# EAGLE design Rev A (New Routing) (EAGLE 9.6.2)
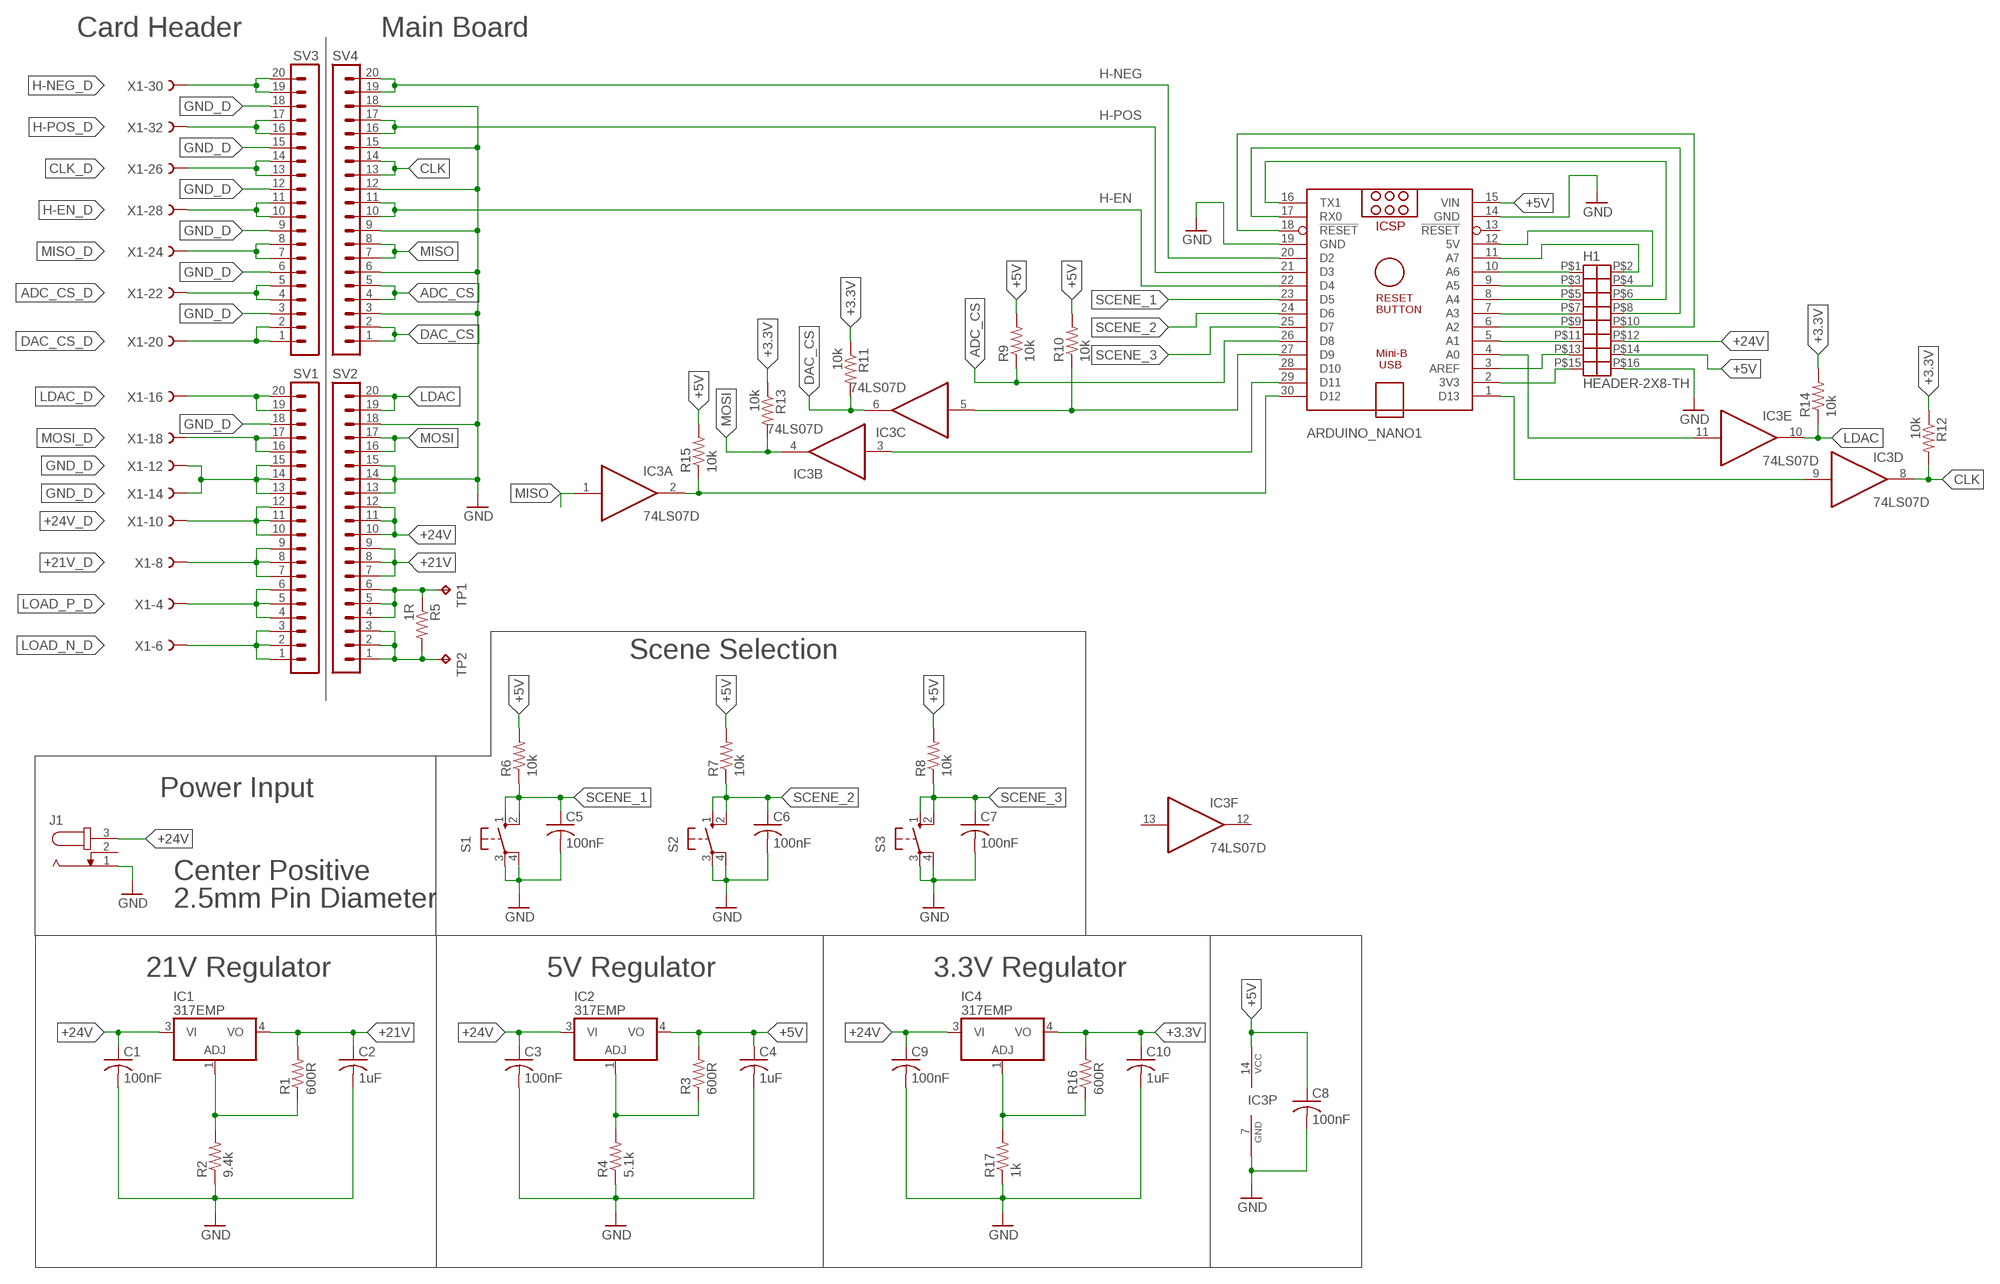
[diagram p0: schematic, sheet 1]

## Parts
ARDUINO_NANO1  ARDUINO_NANO  [ARDUINO_NANO]
C1  100nF  C-USC0603  [C0603]
C2  1uF  C-USC1206  [C1206]
C3  100nF  C-USC0603  [C0603]
C4  1uF  C-USC1206  [C1206]
C5  100nF  C-USC0603  [C0603]
C6  100nF  C-USC0603  [C0603]
C7  100nF  C-USC0603  [C0603]
C8  100nF  C-USC0603  [C0603]
C9  100nF  C-USC0603  [C0603]
C10  1uF  C-USC1206  [C1206]
H1  HEADER-2X8-TH  [HEADER-2X8-TH]
IC1  317EMP  [SOT223]
IC2  317EMP  [SOT223]
IC3  74LS07D  [SO14]
IC4  317EMP  [SOT223]
J1  JACK-PLUG1  [SPC4078]
R1  600R  R-US_R0603  [R0603]
R2  9.4k  R-US_R0603  [R0603]
R3  600R  R-US_R0603  [R0603]
R4  5.1k  R-US_R0603  [R0603]
R5  1R  R-US_R1206  [R1206]
R6  10k  R-US_R0603  [R0603]
R7  10k  R-US_R0603  [R0603]
R8  10k  R-US_R0603  [R0603]
R9  10k  R-US_R0603  [R0603]
R10  10k  R-US_R0603  [R0603]
R11  10k  R-US_R0603  [R0603]
R12  10k  R-US_R0603  [R0603]
R13  10k  R-US_R0603  [R0603]
R14  10k  R-US_R0603  [R0603]
R15  10k  R-US_R0603  [R0603]
R16  600R  R-US_R0603  [R0603]
R17  1k  R-US_R0603  [R0603]
S1  10-XX  [B3F-10XX]
S2  10-XX  [B3F-10XX]
S3  10-XX  [B3F-10XX]
SV1  MA20-1  [MA20-1]
SV2  MA20-1W  [MA20-1W]
SV3  MA20-1  [MA20-1]
SV4  MA20-1W  [MA20-1W]
TP1  TPB2,54  [B2,54]
TP2  TPB2,54  [B2,54]
X1  FH15  [FH15]

## Nets
+3.3V: C10.1 IC4.4(VO) R11.1 R12.1 R13.1 R14.2 R16.2
+5V: ARDUINO_NANO1.15(VIN) C4.1 C8.1 H1.P$14 IC2.4(VO) IC3.14(P:VCC) R3.2 R6.2 R7.2 R8.2 R9.2 R10.2 R15.2
+21V: C2.1 IC1.4(VO) R1.2 SV2.7 SV2.8 SV2.9
+21V_D: SV1.7 SV1.8 SV1.9 X1.8
+24V: C1.1 C3.1 C9.1 H1.P$12 IC1.3(VI) IC2.3(VI) IC4.3(VI) J1.3 SV2.10 SV2.11 SV2.12
+24V_D: SV1.10 SV1.11 SV1.12 X1.10
ADC_CS: ARDUINO_NANO1.26(D8) R9.1 SV4.4 SV4.5
ADC_CS_D: SV3.4 SV3.5 X1.22
CLK: IC3.8(D:O) R12.2 SV4.13 SV4.14
CLK_D: SV3.13 SV3.14 X1.26
DAC_CS: IC3.6(C:O) R11.2 SV4.1 SV4.2
DAC_CS_D: SV3.1 SV3.2 X1.20
GND: ARDUINO_NANO1.14(GND) ARDUINO_NANO1.19(GND) C1.2 C2.2 C3.2 C4.2 C5.2 C6.2 C7.2 C8.2 C9.2 C10.2 H1.P$16 IC3.7(P:GND) J1.1 R2.1 R4.1 R17.1 S1.3(P) S1.4(P1) S2.3(P) S2.4(P1) S3.3(P) S3.4(P1) SV2.13 SV2.14 SV2.15 SV2.18 SV4.3 SV4.6 SV4.9 SV4.12 SV4.15 SV4.18
GND_D: SV1.13 SV1.14 SV1.15 SV1.18 SV3.3 SV3.6 SV3.9 SV3.12 SV3.15 SV3.18 X1.12 X1.14
H-EN_D: SV3.10 SV3.11 X1.28
H-NEG_D: SV3.19 SV3.20 X1.30
H-POS_D: SV3.16 SV3.17 X1.32
LDAC: IC3.10(E:O) R14.1 SV2.19 SV2.20
LDAC_D: SV1.19 SV1.20 X1.16
LOAD_N_D: SV1.1 SV1.2 SV1.3 X1.6
LOAD_P_D: SV1.4 SV1.5 SV1.6 X1.4
MISO: IC3.1(A:I) SV4.7 SV4.8
MISO_D: SV3.7 SV3.8 X1.24
MOSI: IC3.4(B:O) R13.2 SV2.16 SV2.17
MOSI_D: SV1.16 SV1.17 X1.18
N$1: IC2.1(ADJ) R3.1 R4.2
N$2: IC1.1(ADJ) R1.1 R2.2
N$3: ARDUINO_NANO1.20(D2) SV4.19 SV4.20
N$4: ARDUINO_NANO1.2(3V3) H1.P$15
N$5: ARDUINO_NANO1.21(D3) SV4.16 SV4.17
N$6: ARDUINO_NANO1.3(AREF) H1.P$13
N$7: ARDUINO_NANO1.5(A1) H1.P$11
N$8: ARDUINO_NANO1.6(A2) H1.P$9
N$9: ARDUINO_NANO1.22(D4) SV4.10 SV4.11
N$10: ARDUINO_NANO1.7(A3) H1.P$7
N$11: ARDUINO_NANO1.8(A4) H1.P$5
N$12: ARDUINO_NANO1.9(A5) H1.P$3
N$13: ARDUINO_NANO1.10(A6) H1.P$1
N$14: ARDUINO_NANO1.11(A7) H1.P$2
N$15: ARDUINO_NANO1.12(5V) H1.P$4
N$16: ARDUINO_NANO1.16(TX1) H1.P$6
N$17: ARDUINO_NANO1.17(RX0) H1.P$8
N$18: ARDUINO_NANO1.18(!RESET) H1.P$10
N$19: ARDUINO_NANO1.27(D9) IC3.5(C:I) R10.1
N$20: ARDUINO_NANO1.1(D13) IC3.9(D:I)
N$21: ARDUINO_NANO1.29(D11) IC3.3(B:I)
N$22: R5.1 SV2.4 SV2.5 SV2.6 TP1.TP
N$23: R5.2 SV2.1 SV2.2 SV2.3 TP2.TP
N$24: ARDUINO_NANO1.4(A0) IC3.11(E:I)
N$25: ARDUINO_NANO1.30(D12) IC3.2(A:O) R15.1
N$26: IC4.1(ADJ) R16.1 R17.2
SCENE_1: ARDUINO_NANO1.23(D5) C5.1 R6.1 S1.1(S) S1.2(S1)
SCENE_2: ARDUINO_NANO1.24(D6) C6.1 R7.1 S2.1(S) S2.2(S1)
SCENE_3: ARDUINO_NANO1.25(D7) C7.1 R8.1 S3.1(S) S3.2(S1)
Unconnected: ARDUINO_NANO1.13(!RESET) ARDUINO_NANO1.28(D10) IC3.12(F:O) IC3.13(F:I) J1.2

## Notes on the sheet
- Card Header | Main Board
- H-NEG
- H-POS
- H-EN
- Scene Selection
- Power Input
- Center Positive
- 2.5mm Pin Diameter
- 21V Regulator | 5V Regulator | 3.3V Regulator

## Library data of the parts
ARDUINO_NANO1 = ArduinoNanoV30:ARDUINO_NANO: Arduino Nano V3.0 Overview: The Arduino Nano is a small, complete, and breadboard-friendly board based on the ATmega328 (Arduino Nano 3.x) or ATmega168 (Arduino Nano 2.x). It has more or less the same functionality of the Arduino Duemilanove, but in a different package. It lacks only a DC power jack, and works with a Mini-B USB cable instead of a standard one. The Nano was designed and is being produced by Gravitech. Specifications: Microcontroller Atmel ATmega168 or ATmega328 Operating Voltage (logic level) 5 V Input Voltage (recommended) 7-12 V Input Voltage (limits) 6-20 V Digital I/O Pins 14 (of which 6 provide PWM output) Analog Input Pins 8 DC Current per I/O Pin 40 mA Flash Memory 16 KB (ATmega168) or 32 KB (ATmega328) of which 2 KB used by bootloader SRAM 1 KB (ATmega168) or 2 KB (ATmega328) EEPROM 512 bytes (ATmega168) or 1 KB (ATmega328) Clock Speed 16 MHz Dimensions 0.73" x 1.70" Length 45 mm Width 18 mm Weigth 5 g Power: The Arduino Nano can be powered via the Mini-B USB connection, 6-20V unregulated external power supply (pin 30), or 5V regulated external power supply (pin 27). The power source is automatically selected to the highest voltage source. Memory: The ATmega168 has 16 KB of flash memory for storing code (of which 2 KB is used for the bootloader); the ATmega328 has 32 KB, (also with 2 KB used for the bootloader). The ATmega168 has 1 KB of SRAM and 512 bytes of EEPROM (which can be read and written with the EEPROM library); the ATmega328 has 2 KB of SRAM and 1 KB of EEPROM. Input and Output: Each of the 14 digital pins on the Nano can be used as an input or output, using pinMode(), digitalWrite(), and digitalRead() functions. They operate at 5 volts. Each pin can provide or receive a maximum of 40 mA and has an internal pull-up resistor (disconnected by default) of 20-50 kOhms. In addition, some pins have specialized functions. Visit Arduino - ArduinoBoardNano <https://www.arduino.cc/en/Main/ArduinoBoardNano>
C1-C10 = MMIModular Parts:C-US: CAPACITOR, American symbol; SPICEPREFIX: C
H1 = 4ms-main-parts:HEADER-2X8: SMT HEADER 2x8 Unshrouded: Cixi Langling LL1010-5C (HI TEMP 2*8PIN) Shrouded: Cixi Langling LL1007-3 (2*8PIN)
IC1 IC2 IC4 = linear:*317: Positive VOLTAGE REGULATOR
IC3 = 74xx-us:74*07: Hex BUFFER, open collector high-voltage output
J1 = con-jack:JACK-PLUG: DC POWER JACK Power Jack, DC, Right Angle, Through Hole, Rated 5A at 16VDC, PC Terminals Distributor: Farnell (www.Farnell.de) Drawing: 84N1161.pdf / 84N1162.pdf Manufacturer: SPC Technology (www.spctechnology.com) Type: SPC4077 / SPC 4078; OC_FARNELL: unknown; OC_NEWARK: unknown
R1-R17 = MMIModular Parts:R-US_: RESISTOR, American symbol; SPICEPREFIX: R
S1-S3 = switch-omron:10-XX: OMRON SWITCH; MPN: B3F-1000; OC_FARNELL: 176432; OC_NEWARK: 36M3542
SV1 SV3 = con-lstb:MA20-1: PIN HEADER; OC_FARNELL: unknown; OC_NEWARK: unknown
SV2 SV4 = con-lstb:MA20-1W: PIN HEADER; OC_FARNELL: unknown; OC_NEWARK: unknown
TP1 TP2 = testpad:TP: Test pad
X1 = con-vg:FH15: CONNECTOR female, 15 pins, type H, rows DZ

## Board
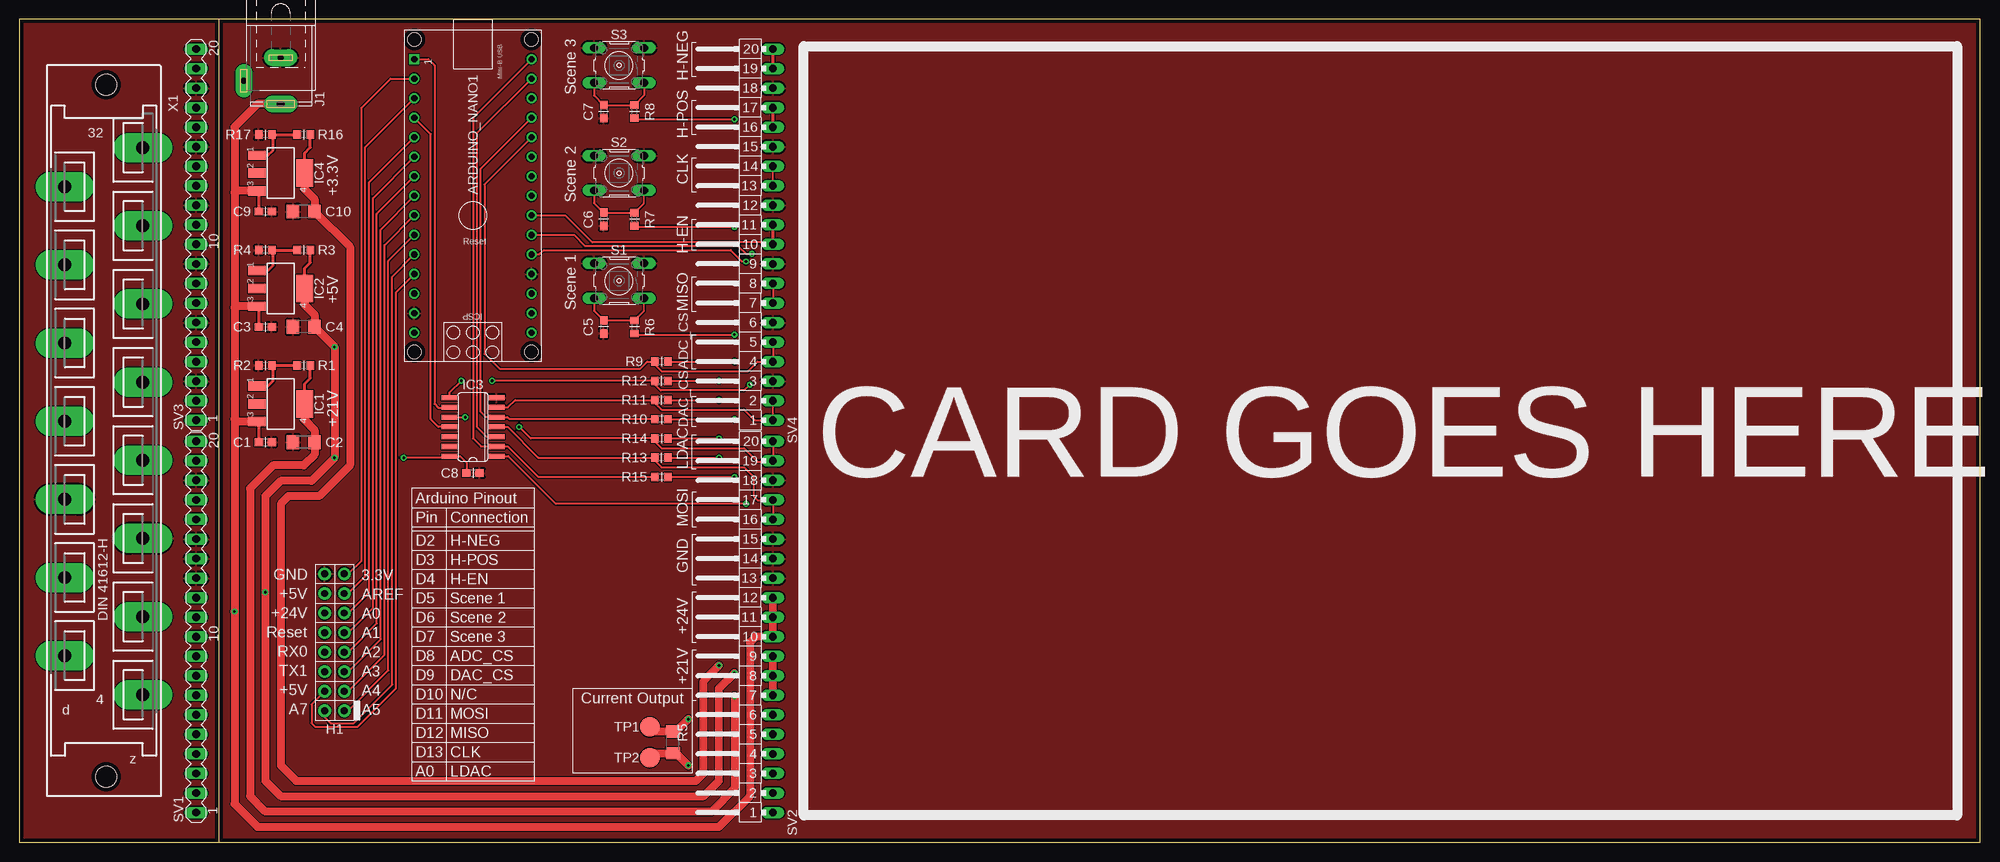
[diagram p1: board, top side]
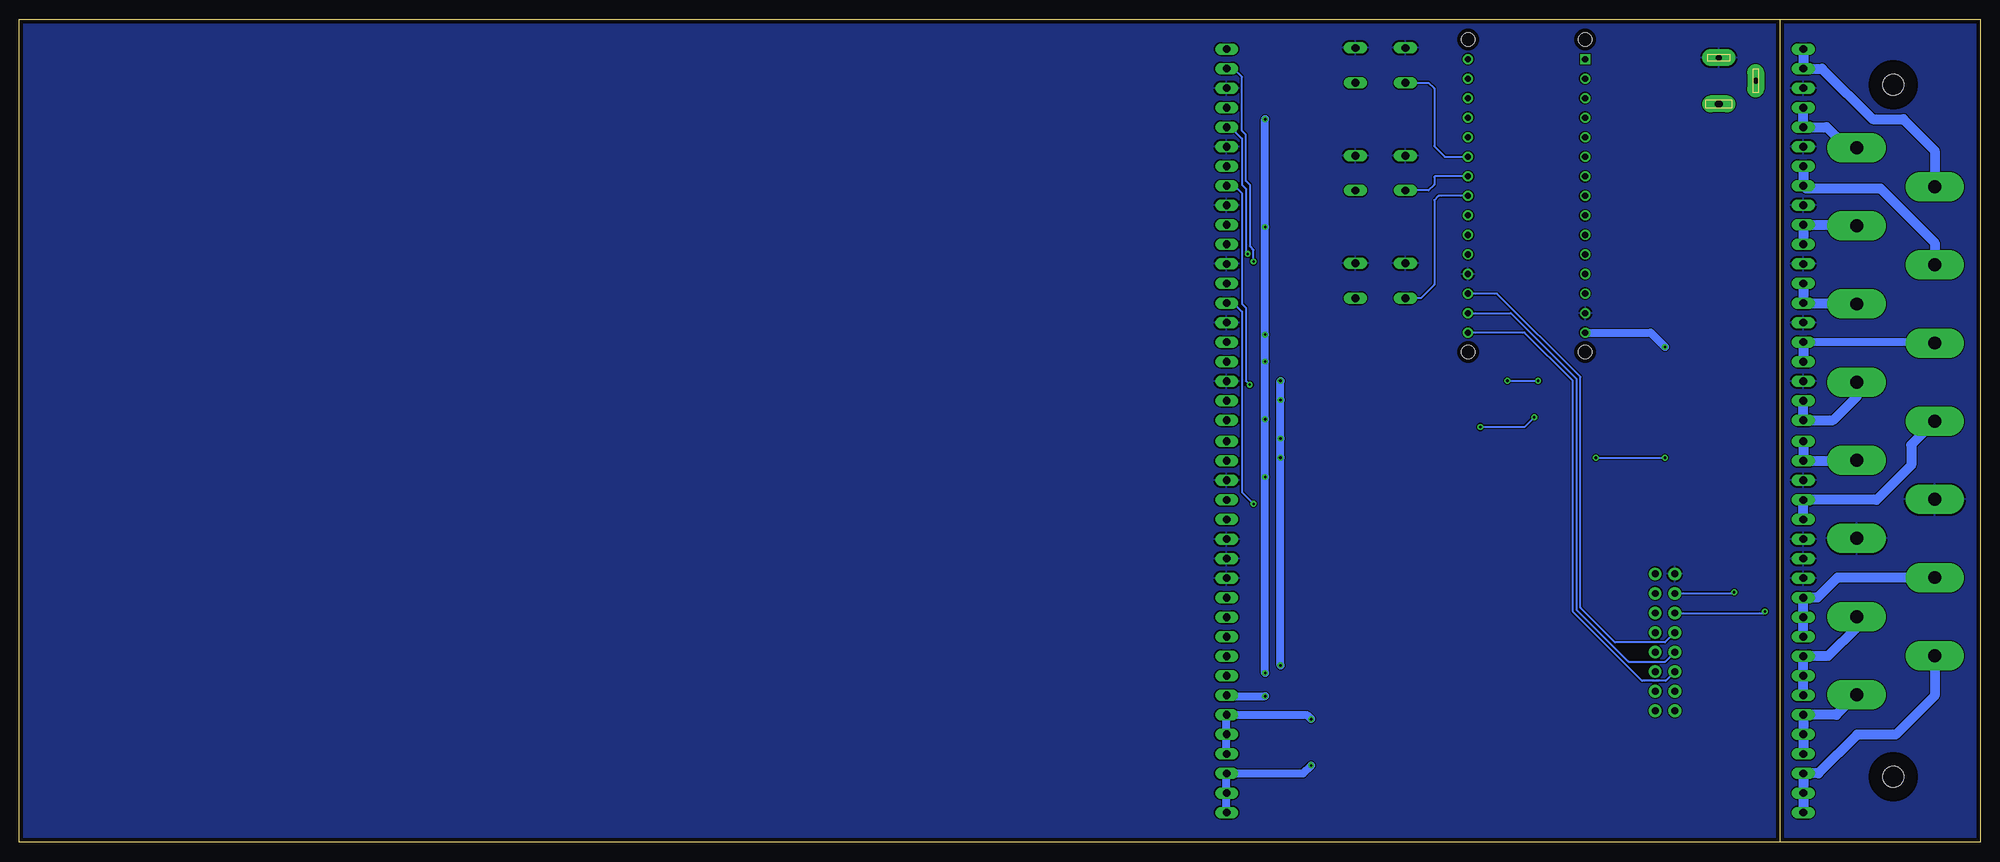
[diagram p2: board, bottom side, seen from below]

Size 255 x 107 mm. Coordinates in mm from the lower left corner, seen from the top.
Outline: 26,0 0,0 0,107 26,107
Outline: 26,0 255,0 255,107 26,107
Outline: 26,0 26,107
Copper layers (1*16): Top 0.035mm / dielectric 1.5mm / Bottom 0.035mm
Design rules "default *": minimum track width 6mil, minimum drill 0.35mm, track to track 6mil, track to pad 6mil, pad to pad 6mil, via to via 6mil, smd to smd 6mil, copper to edge 20mil, drill to drill 6mil, minimum pad ring 10mil, minimum via ring 8mil, stop-mask expansion 4mil, vias tented up to drill 0mil, thermal gap 10mil

### Footprints (pad centres in the part's own frame; a part is rotated, then mirrored left to right if it is on the bottom)
ARDUINO_NANO = drill 0.8 square: 1 -20.32,-7.62 | drill 0.8: 2 -17.78,-7.62; 3 -15.24,-7.62; 4 -12.7,-7.62; 5 -10.16,-7.62; 6 -7.62,-7.62; 7 -5.08,-7.62; 8 -2.54,-7.62; 9 0,-7.62; 10 2.54,-7.62; 11 5.08,-7.62; 12 7.62,-7.62; 13 10.16,-7.62; 14 12.7,-7.62; 15 15.24,-7.62; 16 15.24,7.62; 17 12.7,7.62; 18 10.16,7.62; 19 7.62,7.62; 20 5.08,7.62; 21 2.54,7.62; 22 0,7.62; 23 -2.54,7.62; 24 -5.08,7.62; 25 -7.62,7.62; 26 -10.16,7.62; 27 -12.7,7.62; 28 -15.24,7.62; 29 -17.78,7.62; 30 -20.32,7.62 | hole 1.778: -22.86,-7.62; -22.86,7.62; 17.78,7.62; 17.78,-7.62
C0603 = smd 1.1 x 1: 1 -0.85,0; 2 0.85,0
C1206 = smd 1.6 x 1.8: 1 -1.4,0; 2 1.4,0
HEADER-2X8-TH = drill 0.9 pad 1.651: P$1 -1.27,8.89; P$2 1.27,8.89; P$3 -1.27,6.35; P$4 1.27,6.35; P$5 -1.27,3.81; P$6 1.27,3.81; P$7 -1.27,1.27; P$8 1.27,1.27; P$9 -1.27,-1.27; P$10 1.27,-1.27; P$11 -1.27,-3.81; P$12 1.27,-3.81; P$13 -1.27,-6.35; P$14 1.27,-6.35; P$15 -1.27,-8.89; P$16 1.27,-8.89
SOT223 = smd 1.219 x 2.235: 1 -2.311,-3.099; 2 0,-3.099; 3 2.311,-3.099 | smd 3.6 x 2.2: 4 0,3.099
SO14 = smd 0.66 x 2.032: 1 -3.81,-3.073; 2 -2.54,-3.073; 3 -1.27,-3.073; 4 0,-3.073; 5 1.27,-3.073; 6 2.54,-3.073; 7 3.81,-3.073; 8 3.81,3.073; 9 2.54,3.073; 10 1.27,3.073; 11 0,3.073; 12 -1.27,3.073; 13 -2.54,3.073; 14 -3.81,3.073
SPC4078 = drill 0.8 pad 2.184 long: 1 -3,0; 2 0,-4.8 | drill 1 pad 2.184 long: 3 3,0
R0603 = smd 1 x 1.1: 1 -0.85,0; 2 0.85,0
R1206 = smd 1.6 x 1.803: 1 -1.422,0; 2 1.422,0
B3F-10XX = drill 1.016 long: 1 -3.251,2.261; 2 3.251,2.261; 3 -3.251,-2.261; 4 3.251,-2.261
MA20-1 = drill 1.016 long: 1 -24.13,0; 2 -21.59,0; 3 -19.05,0; 4 -16.51,0; 5 -13.97,0; 6 -11.43,0; 7 -8.89,0; 8 -6.35,0; 9 -3.81,0; 10 -1.27,0; 11 1.27,0; 12 3.81,0; 13 6.35,0; 14 8.89,0; 15 11.43,0; 16 13.97,0; 17 16.51,0; 18 19.05,0; 19 21.59,0; 20 24.13,0
MA20-1W = drill 1.016 long: 1 -24.13,0; 2 -21.59,0; 3 -19.05,0; 4 -16.51,0; 5 -13.97,0; 6 -11.43,0; 7 -8.89,0; 8 -6.35,0; 9 -3.81,0; 10 -1.27,0; 11 1.27,0; 12 3.81,0; 13 6.35,0; 14 8.89,0; 15 11.43,0; 16 13.97,0; 17 16.51,0; 18 19.05,0; 19 21.59,0; 20 24.13,0
B2,54 = smd 2.54 x 2.54: TP 0,0
FH15 = drill 1.676 pad 3.81 long: 4 -5.08,34.315; 6 5.08,29.235; 8 -5.08,24.155; 10 5.08,19.075; 12 -5.08,13.995; 14 5.08,8.915; 16 -5.08,3.835; 18 5.08,-1.245; 20 -5.08,-6.325; 22 5.08,-11.405; 24 -5.08,-16.485; 26 5.08,-21.565; 28 -5.08,-26.645; 30 5.08,-31.725; 32 -5.08,-36.805 | hole 2.794: -0.305,44.983; -0.305,-44.983

### Placement (x,y rotation side)
ARDUINO_NANO1  59,81.5 270 top
C1  32,52 0 top
C2  37,52 180 top
C3  32,67 0 top
C4  37,67 180 top
C5  76,67 270 top
C6  76,81 270 top
C7  76,95 270 top
C8  59,48 0 top
C9  32,82 0 top
C10  37,82 180 top
H1  41,26 180 top
IC1  34,57 270 top
IC2  34,72 270 top
IC3  59,54 90 top
IC4  34,87 270 top
J1  34,99 270 top
R1  37,62 0 top
R2  32,62 0 top
R3  37,77 0 top
R4  32,77 0 top
R5  85,13 270 top
R6  80,67 270 top
R7  80,81 270 top
R8  80,95 270 top
R9  83.5,62.5 0 top
R10  83.5,55 0 top
R11  83.5,57.5 180 top
R12  83.5,60 180 top
R13  83.5,50 180 top
R14  83.5,52.5 0 top
R15  83.5,47.5 0 top
R16  37,92 0 top
R17  32,92 0 top
S1  78,73 180 top
S2  78,87 180 top
S3  78,101 180 top
SV1  23,28 90 top
SV2  98,28 90 top
SV3  23,79 90 top
SV4  98,79 90 top
TP1  82,15 90 top
TP2  82,11 90 top
X1  11,53.5 180 top

### Tracks (layer width: path | path; a pad name or v marks a point on that pad's centre or on a via)
+3.3V  (via drill 0.35)
  Top 0.254: R12.1 v91,60 | R11.1 v91,57.5 | R14.2 v91,52.5 | R13.1 v91,50
  Top 0.406: IC4.4 37.1,89.6 37.85,90.35 R16.2
  Top 1.016: IC4.4 37.1,84.9 38.4,83.6 C10.1 43,77.4 43,49 39,45 35,45 34,44 34,10 36,8 88,8 89,9 89,21 v91,23
  Bottom 1.016: v91,23 v91,50 v91,52.5 v91,57.5 v91,60
+5V  (via drill 0.35)
  Top 0.254: C8.1 58.15,49.35 57.31,50.19 IC3.14 55.74,50 v50,50 | R10.2 v93,55 | R15.2 v93,47.5 | R9.2 v93,62.5 | R6.2 80.15,66 v93,66 | R7.2 80.15,80 v93,80 | R8.2 80.15,94 v93,94
  Top 0.406: IC2.4 37.1,74.6 37.85,75.35 R3.2
  Top 1.016: IC2.4 37.1,69.9 38.4,68.6 C4.1 v41,64.4 v41,50 38,47 34,47 32,45 v32,32.5 32,8 34,6 89,6 91,8 91,20 v93,22
  Bottom 0.254: v50,50 v41,50 | H1.P$14 32.15,32.35 v32,32.5
  Bottom 1.016: v93,22 v93,47.5 v93,55 v93,62.5 v93,66 v93,80 v93,94 | ARDUINO_NANO1.15 42.86,66.26 v41,64.4
+21V  (via drill 0.35)
  Top 0.406: IC1.4 37.1,59.6 37.85,60.35 R1.2
  Top 1.016: IC1.4 37.1,54.9 38.4,53.6 C2.1 38.4,50.4 37,49 33,49 30,46 30,6 32,4 90,4 93,7 v93,19 | SV2.7 SV2.8 SV2.9
  Bottom 1.016: SV2.7 97.89,19 v93,19
+21V_D
  Bottom 1.27: SV1.7 SV1.8 SV1.9 19.81,24.19 16.08,27.92 X1.8
+24V  (via drill 0.35)
  Top 0.406: IC1.3 31.15,54.44 C1.1 | IC2.3 31.15,69.44 C3.1 | IC4.3 31.15,84.44 C9.1
  Top 1.016: J1.3 31,96 28,93 28,84.5 | 28,84.5 28,69.5 | 28,69.5 28,55 | 28,55 v28,30 28,5 31,2 91,2 95,6 95,26 95.73,26.73 SV2.10 SV2.11 SV2.12 | IC1.3 28.31,54.69 28,55 | IC2.3 28.19,69.69 28,69.5 | IC4.3 28.19,84.69 28,84.5
  Bottom 0.254: H1.P$12 28.19,29.81 v28,30
+24V_D
  Bottom 1.27: SV1.10 SV1.11 SV1.12 21.19,31.81 18.57,34.42 X1.10
ADC_CS
  Top 0.254: SV4.5 SV4.4 96,62.5 94.75,61.25 83.5,61.25 82.65,62.1 R9.1 81.65,62.5 80.65,61.5 62.5,61.5 60.5,63.5 60.5,85.54 ARDUINO_NANO1.26
ADC_CS_D
  Bottom 1.016: X1.22 6.04,65.03 SV3.5
  Bottom 1.27: SV3.5 SV3.4
CLK  (via drill 0.35)
  Top 0.254: v61.5,60 R12.2 82.65,59.5 83.4,58.75 94.25,58.75 v95,59.5 | IC3.8 55.93,58.43 v57.5,60 | SV4.13 SV4.14
  Bottom 0.254: v61.5,60 v57.5,60 | v95,59.5 95.5,60 95.5,69.5 96,70 96,84.35 97,85.35 SV4.13
CLK_D
  Bottom 1.27: SV3.14 SV3.13 22.65,85 13,85 5.92,77.92 X1.26
DAC_CS
  Top 0.254: IC3.6 63.54,56.54 64.5,57.5 R11.2 82.65,57.1 83.5,56.25 94.25,56.25 95.63,54.87 SV4.1 SV4.2
DAC_CS_D
  Bottom 1.27: SV3.2 SV3.1 19.13,54.87 16.08,57.92 X1.20
GND
  pour Top: 26,109.5 26,-3 257.5,-3 257.5,109.5 26.5,109.5
  pour Bottom: 26,111 26,-4.5 259,-4.5 259,111
GND_D
  pour Top: -1,-1 26,-1 26,107 -1,107
  pour Bottom: -2,-1 26,-1 26,108 -2,108
H-EN_D
  Bottom 1.27: SV3.10 SV3.11 16.2,80.27 X1.28
H-NEG_D
  Bottom 1.27: SV3.20 SV3.19 20.59,100.59 14,94 10,94 5.92,89.92 X1.30
H-POS_D
  Bottom 1.27: SV3.17 SV3.16 19.97,92.97 17.3,90.31 X1.32
LDAC  (via drill 0.35)
  Top 0.254: v65,54 66.5,52.5 R14.1 82.65,52.1 83.5,51.25 94.25,51.25 96,49.5 97.91,49.5 97.95,49.55 SV2.19 SV2.20 | IC3.10 57.98,55.27 v58,55.25
  Bottom 0.254: v65,54 59.25,54 v58,55.25
LDAC_D
  Bottom 1.27: SV1.20 SV1.19 16.16,49.59 X1.16
LOAD_N_D
  Bottom 1.27: X1.6 5.92,19.08 11,14 16,14 21.05,8.95 SV1.3 SV1.2 SV1.1
LOAD_P_D
  Bottom 1.27: X1.4 18.7,16.57 SV1.6 SV1.5 SV1.4
MISO  (via drill 0.35)
  Top 0.254: IC3.1 63.57,50.19 69.76,44 v94.5,44 | SV4.8 SV4.7
  Bottom 0.254: SV4.7 97.11,70.11 96,69 96,45.5 v94.5,44
MISO_D
  Bottom 1.27: SV3.8 SV3.7 16.2,70.11 X1.24
MOSI
  Top 0.254: IC3.4 63.5,54 67.5,50 R13.2 82.65,49.6 83.5,48.75 94.25,48.75 95.5,47.5 95.5,45 96,44.5 SV2.17 SV2.16
MOSI_D
  Bottom 1.27: SV1.16 SV1.17 13.49,44.51 9,49 9,51.66 X1.18
N$1
  Top 0.406: IC2.1 32.31,74.31 33,75 33,76.85 R4.2 R3.1
N$2
  Top 0.406: IC1.1 32.31,59.31 33,60 33,61.85 R2.2 R1.1
N$3  (via drill 0.35)
  Top 0.254: ARDUINO_NANO1.20 67.62,76.42 68.2,77 92.5,77 94,75.5 v94.5,75.5
  Top 0.406: SV4.19 SV4.20
  Bottom 0.254: SV4.19 97.09,100.59 96,99.5 96,92.5 95.5,92 95.5,86 95,85.5 95,77.5 94.5,77 v94.5,75.5
N$4
  Top 0.254: H1.P$15 42.77,34.89 44.5,36.62 44.5,95.5 48.28,99.28 ARDUINO_NANO1.2
N$5  (via drill 0.35)
  Top 0.254: ARDUINO_NANO1.21 72.12,78.96 73.58,77.5 93.5,77.5 94.5,76.5 v95.25,76.5
  Top 0.406: SV4.16 SV4.17
  Bottom 0.254: v95.25,76.5 95.5,76.75 95.5,84.97 96,85.47 96,91.47 97.5,92.97 SV4.16
N$6
  Top 0.254: H1.P$13 42.77,32.35 45,34.58 45,90.36 ARDUINO_NANO1.3
N$7
  Top 0.254: H1.P$11 42.77,29.81 45.5,32.54 45.5,85.78 ARDUINO_NANO1.5
N$8
  Top 0.254: H1.P$9 42.77,27.27 46,30.5 46,83.74 ARDUINO_NANO1.6
N$9
  Top 0.254: ARDUINO_NANO1.22 71,81.5 74.5,78 97.73,78 SV4.10
  Top 0.406: SV4.10 SV4.11
N$10
  Top 0.254: H1.P$7 42.77,24.73 46.5,28.46 46.5,81.7 ARDUINO_NANO1.7
N$11
  Top 0.254: H1.P$5 42.77,22.19 47,26.42 47,79.66 ARDUINO_NANO1.8
N$12
  Top 0.254: H1.P$3 42.77,19.65 47.5,24.38 47.5,77.62 ARDUINO_NANO1.9
N$13
  Top 0.254: H1.P$1 42.77,17.11 48,22.34 48,75.58 ARDUINO_NANO1.10
N$14
  Top 0.254: H1.P$2 39.73,16.27 40.5,15.5 43.5,15.5 48.5,20.5 48.5,73.54 ARDUINO_NANO1.11
N$15
  Top 0.254: H1.P$4 38,17.92 38,15.5 38.5,15 44,15 49,20 49,71.5 ARDUINO_NANO1.12
N$16
  Bottom 0.254: H1.P$6 40.92,21 44,21 53,30 53,60 59.26,66.26 ARDUINO_NANO1.16
N$17
  Bottom 0.254: ARDUINO_NANO1.17 61.05,68.8 52.5,60.25 52.5,30.25 45.75,23.5 40.96,23.5 H1.P$8
N$18
  Bottom 0.254: H1.P$10 41,26 47.5,26 52,30.5 52,60.5 62.84,71.34 ARDUINO_NANO1.18
N$19
  Top 0.254: ARDUINO_NANO1.27 60,87.58 60,56 60.73,55.27 IC3.5 63.48,55.27 63.75,55 R10.1
N$20
  Top 0.254: ARDUINO_NANO1.1 53.18,101.82 54,101 54,57 54.5,56.5 55.89,56.5 IC3.9
N$21
  Top 0.254: ARDUINO_NANO1.29 59.5,92.16 59.5,54 60.77,52.73 IC3.3
N$22  (via drill 0.35)
  Top 1.016: v87,16 85.42,14.42 R5.1 82.58,14.42 TP1.TP
  Bottom 1.016: v87,16 87.57,16.57 SV2.6 SV2.5 SV2.4
N$23  (via drill 0.35)
  Top 1.016: v87,10 85.42,11.58 R5.2 82.58,11.58 TP2.TP
  Bottom 1.016: v87,10 88.05,8.95 SV2.3 SV2.2 SV2.1
N$24
  Top 0.254: IC3.11 54.5,54 53.5,55 53.5,92.08 ARDUINO_NANO1.4
N$25
  Top 0.254: ARDUINO_NANO1.30 59,94.2 59,52.5 60.04,51.46 IC3.2 63.54,51.46 67.5,47.5 R15.1
N$26
  Top 0.406: IC4.1 32.31,89.31 33,90 33,91.85 R17.2 R16.1
SCENE_1
  Top 0.254: S1.2 74.75,69.1 C5.1 R6.1 81.25,69.1 S1.1
  Bottom 0.254: ARDUINO_NANO1.23 70.46,84.04 71,83.5 71,72.5 72.76,70.74 S1.2
SCENE_2
  Top 0.254: S2.2 74.75,83.1 C6.1 R7.1 81.25,83.1 S2.1
  Bottom 0.254: ARDUINO_NANO1.24 70.92,86.58 71,86.5 71,85.5 71.76,84.74 S2.2
SCENE_3
  Top 0.254: S3.2 74.75,97.1 C7.1 R8.1 81.25,97.1 S3.1
  Bottom 0.254: S3.2 71.74,98.74 71,98 71,90.5 69.62,89.12 ARDUINO_NANO1.25

### Text on the board
tPlace: Scene 3 | H-NEG | Scene 2 | H-POS | CLK | +3.3V | Scene 1 | H-EN | +5V | MISO | ADC_CS | +21V | DAC_CS | CARD GOES HERE | LDAC | Arduino Pinout | Pin | Connection | MOSI | D2 | H-NEG | D3 | H-POS | GND | GND | 3.3V | +5V | D4 | H-EN | +24V | AREF | D5 | Scene 1 | A0 | D6 | Scene 2 | Reset | A1 | +24V | D7 | Scene 3 | RX0 | A2 | TX1 | D8 | ADC_CS | +5V | A3 | D9 | DAC_CS | +21V | A4 | D10 | N/C | A7 | Current Output | A5 | D11 | MOSI | D12 | MISO | D13 | CLK | A0 | LDAC